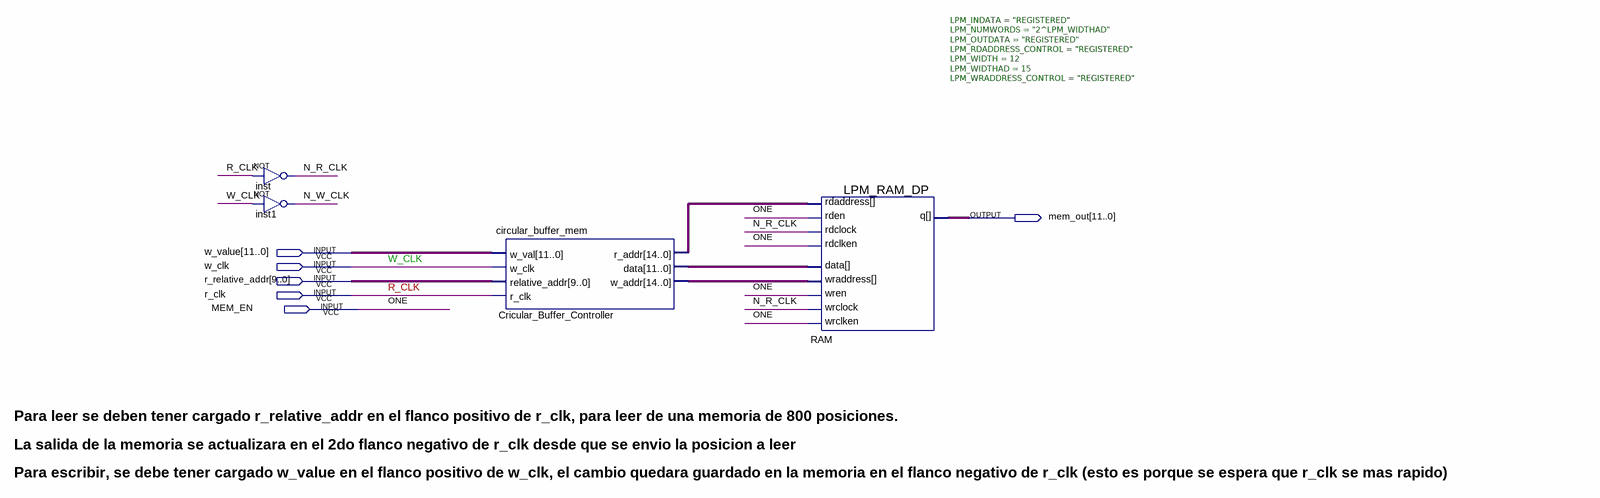
[diagram p0: schematic sheet]
// Quartus schematic graph_memory.bdf as structural Verilog: 4 symbols, 6 pins
module graph_memory (
  input  [11:0] w_value,
  input  w_clk,
  input  [9:0] r_relative_addr,
  input  r_clk,
  input  MEM_EN,
  output [11:0] mem_out
);

  wire N_R_CLK, N_W_CLK;
  wire [11:0] Cricular_Buffer_Controller_data;
  wire [14:0] Cricular_Buffer_Controller_r_addr, Cricular_Buffer_Controller_w_addr;

  not inst (N_R_CLK, r_clk);
  not inst1 (N_W_CLK, w_clk);
  circular_buffer_mem Cricular_Buffer_Controller (
    .w_val(w_value), .w_clk(w_clk), .relative_addr(r_relative_addr), .r_clk(r_clk),
    .r_addr(Cricular_Buffer_Controller_r_addr), .data(Cricular_Buffer_Controller_data),
    .w_addr(Cricular_Buffer_Controller_w_addr));
  LPM_RAM_DP #(.LPM_INDATA("REGISTERED"), .LPM_NUMWORDS("2^LPM_WIDTHAD"), .LPM_OUTDATA("REGISTERED"), .LPM_RDADDRESS_CONTROL("REGISTERED"), .LPM_WIDTH(12), .LPM_WIDTHAD(15), .LPM_WRADDRESS_CONTROL("REGISTERED")) RAM (
    .rden(MEM_EN), .rdclock(N_R_CLK), .rdclken(MEM_EN), .wren(MEM_EN), .wrclock(N_R_CLK), .wrclken(MEM_EN),
    .rdaddress(Cricular_Buffer_Controller_r_addr), .data(Cricular_Buffer_Controller_data),
    .wraddress(Cricular_Buffer_Controller_w_addr), .q(mem_out));

  // Other names for the same wires on the sheet: ONE = MEM_EN

  // Notes on the sheet:
  //   Para leer se deben tener cargado r_relative_addr en el flanco positivo de r_clk, para leer de una memoria de 800 posiciones.
  //   La salida de la memoria se actualizara en el 2do flanco negativo de r_clk desde que se envio la posicion a leer
  //   Para escribir, se debe tener cargado w_value en el flanco positivo de w_clk, el cambio quedara guardado en la memoria en el flanco negativo de r_clk (esto es porque se espera que r_clk se mas rapido)
endmodule
